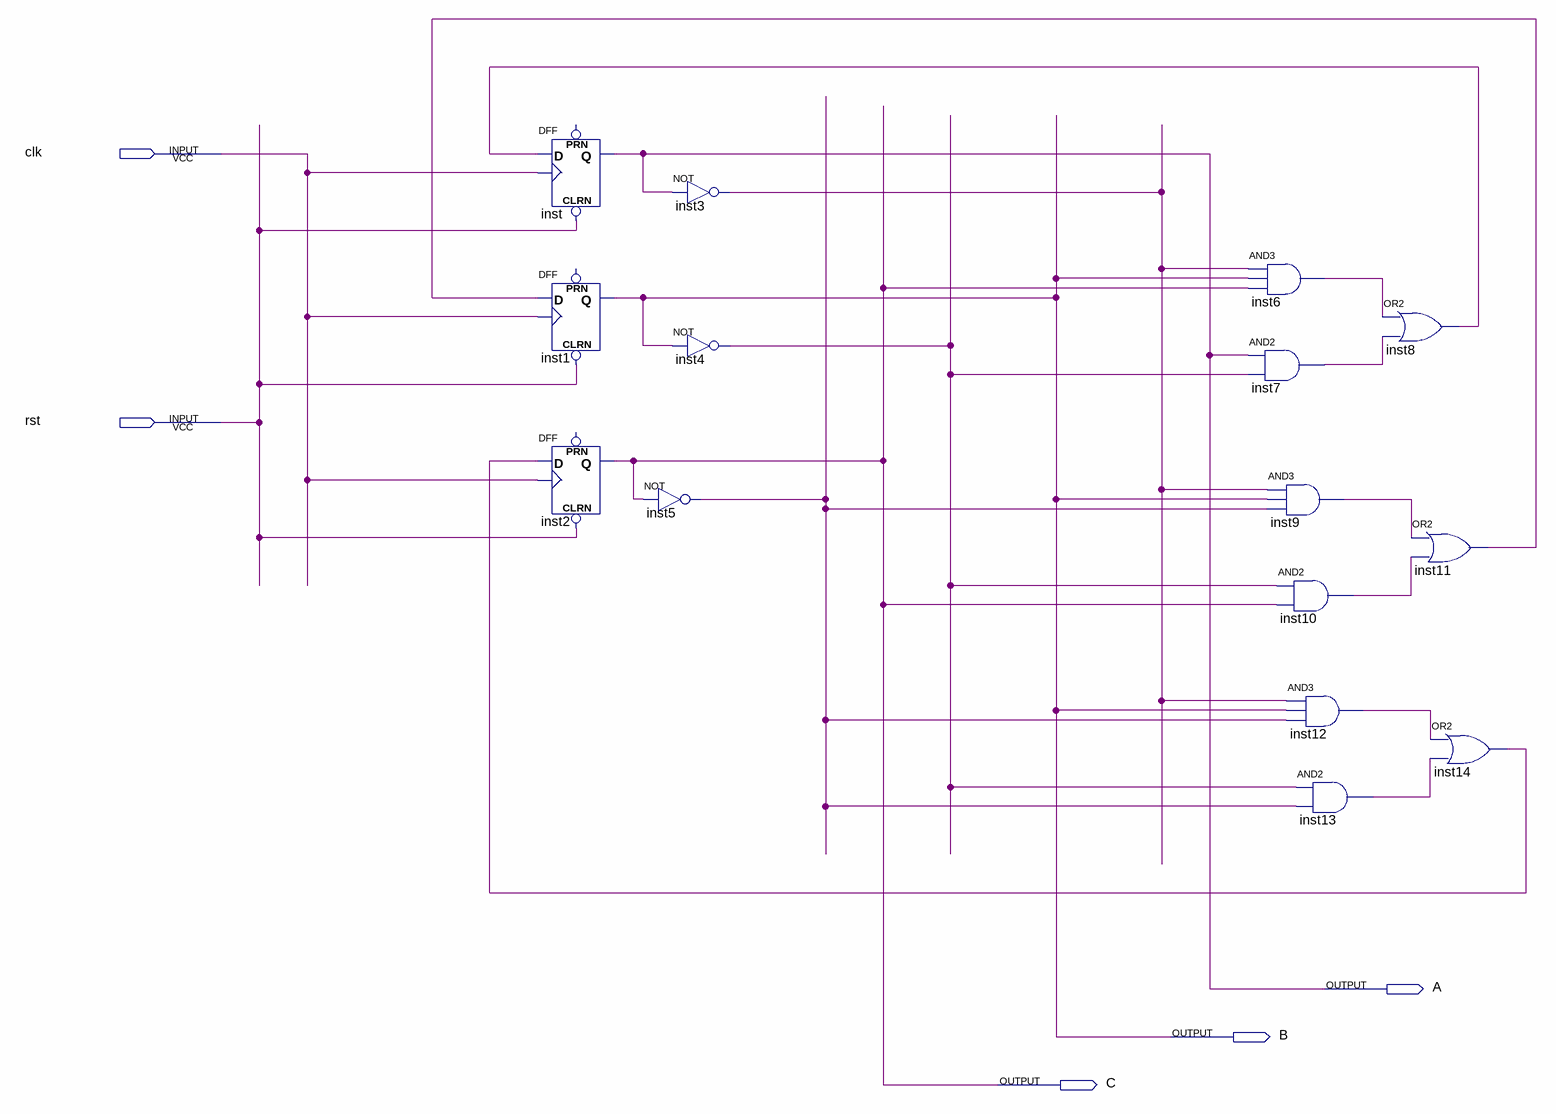
[diagram p0: schematic sheet]
// Quartus schematic count_7.bdf as structural Verilog: 15 symbols, 5 pins
module count_7 (
  input  clk,
  input  rst,
  output A,
  output B,
  output C
);

  wire inst3_out, inst4_out, inst5_out, inst6_out, inst7_out, inst8_out, inst9_out, inst10_out, inst11_out,
       inst12_out, inst13_out, inst14_out;

  DFF inst (.CLRN(rst), .CLK(clk), .D(inst8_out), .Q(A));  // open: PRN
  DFF inst1 (.CLRN(rst), .CLK(clk), .D(inst11_out), .Q(B));  // open: PRN
  DFF inst2 (.CLRN(rst), .CLK(clk), .D(inst14_out), .Q(C));  // open: PRN
  not inst3 (inst3_out, A);
  not inst4 (inst4_out, B);
  not inst5 (inst5_out, C);
  and inst6 (inst6_out, inst3_out, B, C);
  and inst7 (inst7_out, A, inst4_out);
  and inst9 (inst9_out, inst3_out, B, inst5_out);
  and inst10 (inst10_out, inst4_out, C);
  and inst12 (inst12_out, inst3_out, B, inst5_out);
  and inst13 (inst13_out, inst4_out, inst5_out);
  or inst8 (inst8_out, inst6_out, inst7_out);
  or inst11 (inst11_out, inst9_out, inst10_out);
  or inst14 (inst14_out, inst12_out, inst13_out);
endmodule
